# Altium schematic sheet 3_MCU.SchDoc
size A
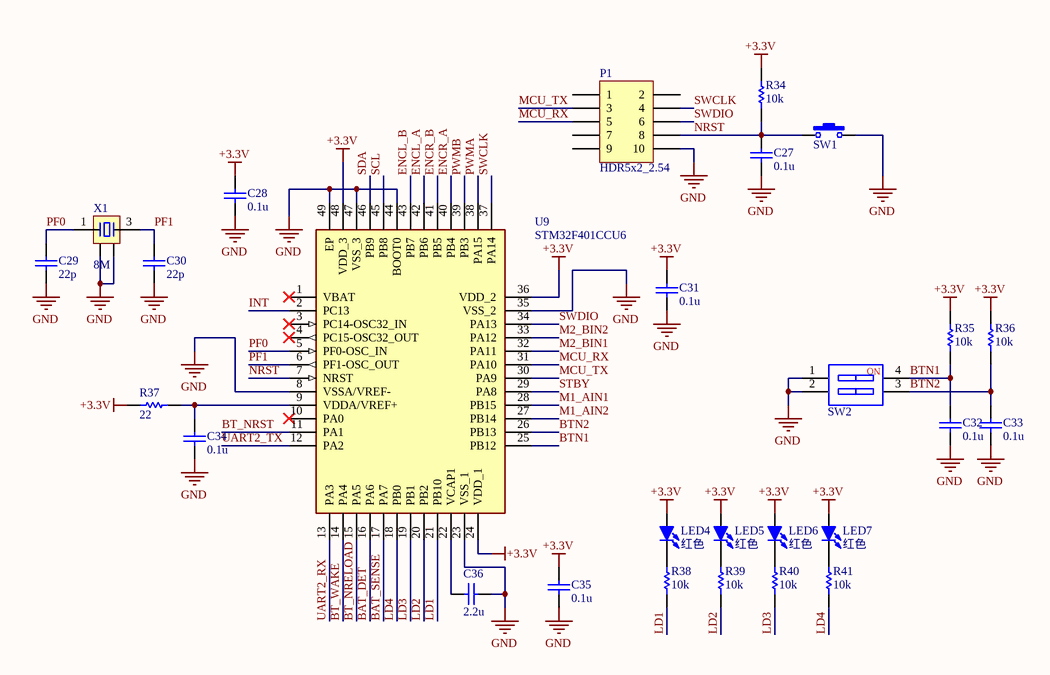
[diagram p0: 3_MCU.SchDoc]

## Parts
C27  0.1u  [CAP_0603_SMD]
C28  0.1u  [CAP_0603_SMD]
C29  22p  [CAP_0603_SMD]
C30  22p  [CAP_0603_SMD]
C31  0.1u  [CAP_0603_SMD]
C32  0.1u  [CAP_0603_SMD]
C33  0.1u  [CAP_0603_SMD]
C34  0.1u  [CAP_0603_SMD]
C35  0.1u  [CAP_0603_SMD]
C36  2.2u  [CAP_0603_SMD]
LED4  红色  [LED0603_Y]
LED5  红色  [LED0603_Y]
LED6  红色  [LED0603_Y]
LED7  红色  [LED0603_Y]
P1  HDR5x2_2.54  [HDR5x2_2.54]
R34  10k  [RES_0603_SMD]
R35  10k  [RES_0603_SMD]
R36  10k  [RES_0603_SMD]
R37  22  [RES_0603_SMD]
R38  10k  [RES_0603_SMD]
R39  10k  [RES_0603_SMD]
R40  10k  [RES_0603_SMD]
R41  10k  [RES_0603_SMD]
SW1  3x6x5  [SW SMD-3*6*4.3]  (value not drawn)
SW2  SW-2P  [SW1.27 SMD-2P]  (value not drawn)
U9  STM32F401CCU6  [QFN50P700X700X60-49N-D]
X1  8M  [OSC 3225-4P]

## Nets
+3.3V: C28.1 C31.1 C35.1 LED4.1(A) LED5.1(A) LED6.1(A) LED7.1(A) R34.2 R35.1 R36.1 R37.2 U9.24(VDD_1) U9.36(VDD_2) U9.48(VDD_3)
GND: C27.1 C28.2 C29.2 C30.2 C31.2 C32.1 C33.1 C34.2 C35.2 C36.1 P1.10 SW1.2 SW2.1 SW2.2 U9.8(VSSA/VREF-) U9.23(VSS_1) U9.35(VSS_2) U9.44(BOOT0) U9.47(VSS_3) U9.49(EP) X1.2 X1.4
BAT_DET: U9.16(PA6)
BAT_SENSE: U9.17(PA7)
BT_NRELOAD: U9.15(PA5)
BT_NRST: U9.11(PA1)
BT_WAKE: U9.14(PA4)
BTN1: C32.2 R35.2 SW2.4 U9.25(PB12)
BTN2: C33.2 R36.2 SW2.3 U9.26(PB13)
ENCL_A: U9.42(PB6)
ENCL_B: U9.43(PB7)
ENCR_A: U9.40(PB4)
ENCR_B: U9.41(PB5)
INT: U9.2(PC13)
LD1: R38.2 U9.21(PB10)
LD2: R39.2 U9.20(PB2)
LD3: R40.2 U9.19(PB1)
LD4: R41.2 U9.18(PB0)
M1_AIN1: U9.28(PB15)
M1_AIN2: U9.27(PB14)
M2_BIN1: U9.32(PA11)
M2_BIN2: U9.33(PA12)
MCU_RX: P1.5 U9.31(PA10)
MCU_TX: P1.3 U9.30(PA9)
NRST: C27.2 P1.8 R34.1 SW1.1 U9.7(NRST)
PF0: C29.1 U9.5(PF0-OSC_IN) X1.1
PF1: C30.1 U9.6(PF1-OSC_OUT) X1.3
PWMA: U9.38(PA15)
PWMB: U9.39(PB3)
SCL: U9.45(PB8)
SDA: U9.46(PB9)
STBY: U9.29(PA8)
SWCLK: P1.4 U9.37(PA14)
SWDIO: P1.6 U9.34(PA13)
UART2_RX: U9.13(PA3)
UART2_TX: U9.12(PA2)
NetC34_1: C34.1 R37.1 U9.9(VDDA/VREF+)
NetC36_2: C36.2 U9.22(VCAP1)
NetLED4_2: LED4.2(K) R38.1
NetLED5_2: LED5.2(K) R39.1
NetLED6_2: LED6.2(K) R40.1
NetLED7_2: LED7.2(K) R41.1

Not connected (* = marked no-connect by the designer): P1 1 2 7 9; U9 1(VBAT)* 3(PC14-OSC32_IN)* 4(PC15-OSC32_OUT)* 10(PA0)*

## Notes on the sheet
- (in symbol SW-2P) NO

## Library data of the parts
C27-C36 = CAP_0603_SMD: Capacitor, 0603, SMD; Published: 8-Jun-2000; LatestRevisionDate: 17-Jul-2002; LatestRevisionNote: Re-released for DXP Platform.; PackageReference: RAD-0.3; Publisher: Altium Limited
LED4-LED7 = LED-SMD: 贴片LED; 封装库来自淘宝卖家 ID：黄晶宝石: 其他店铺购入均为假冒，请立即申请退款，本店奖励现金5~20元; BOM名称: 贴片LED
P1 = HDR5x2_2.54: Header, 10-Pin, 2-Row; LatestRevisionDate: 17-Jul-2002; LatestRevisionNote: Re-released for DXP Platform.; Publisher: Altium Limited
R34-R41 = RES_0603_SMD: Resistor, 0603, SMD; Published: 8-Jun-2000; LatestRevisionDate: 17-Jul-2002; LatestRevisionNote: Re-released for DXP Platform.; PackageReference: AXIAL-0.3; Publisher: Altium Limited; Value: Value
SW1 = SW-PB: 微动开关; BOM名称: 3x6轻触开关; 联系卖家，免费查找封装: 唯一出售店铺网址https://shop463601444.taobao.com
SW2 = SW-2P: 2路编码开关; 联系卖家，免费查找封装: 唯一出售店铺网址https://shop463601444.taobao.com; BOM名称: 2路编码开关
U9 = STM32F401CCU6: Integrated Circuit; Manufacturer_Name: STMicroelectronics; Datasheet Link: http://www.st.com/web/en/resource/technical/document/datasheet/DM00086815.pdf; Height: 0.6mm; Manufacturer_Part_Number: STM32F401CCU6; Mouser Part Number: 511-STM32F401CCU6; Mouser Price/Stock: https://www.mouser.co.uk/ProductDetail/STMicroelectronics/STM32F401CCU6?qs=DqCdCwOw4%2F5VrOZQxO795A%3D%3D; Arrow Part Number: STM32F401CCU6; Arrow Price/Stock: https://www.arrow.com/en/products/stm32f401ccu6/stmicroelectronics
X1 = XTAL-4P: 4脚无源晶振; 联系卖家，免费查找封装: 唯一出售店铺网址https://shop463601444.taobao.com; BOM名称: 4脚无源晶振